# EAGLE design SolarBoard version 2.0 (EAGLE 7.6.0)
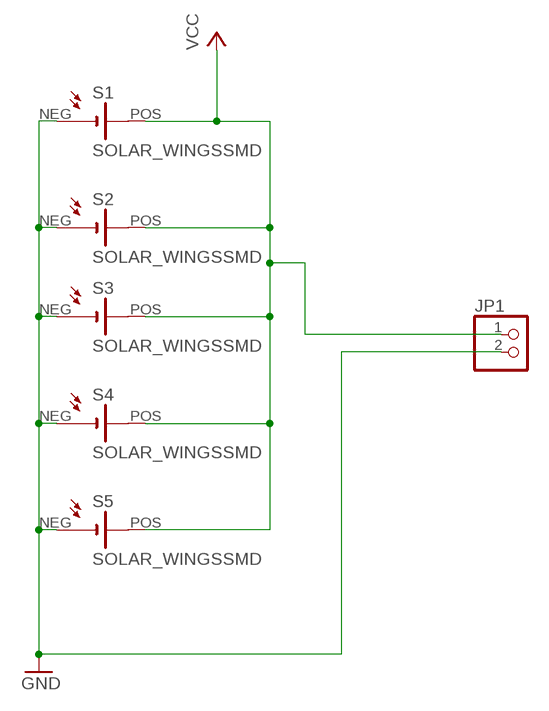
[diagram p0: schematic, sheet 1]

## Parts
JP1  PINHD-1X2  [1X02]
S1  SOLAR_WINGSSMD  [SOLAR_WINGS_SMD]
S2  SOLAR_WINGSSMD  [SOLAR_WINGS_SMD]
S3  SOLAR_WINGSSMD  [SOLAR_WINGS_SMD]
S4  SOLAR_WINGSSMD  [SOLAR_WINGS_SMD]
S5  SOLAR_WINGSSMD  [SOLAR_WINGS_SMD]

## Nets
GND: JP1.2 S1.NEG S2.NEG S3.NEG S4.NEG S5.NEG
VCC: JP1.1 S1.POS S2.POS S3.POS S4.POS S5.POS

## Library data of the parts
JP1 = pinhead:PINHD-1X2: PIN HEADER
S1-S5 = trisolx-ks:SOLAR_WINGS: 1 Sun: AM 1.5G -(100 mW/cm2) @ 25ᵒC, Voltage (Open Circuit): 2.62 V, Voltage (Max Power):2.33 V, Current (Max Power):14.6 mA, Power (Max Power): 34 mW, Efficiency: 28%, Temp Coeff. V (Max Power): -6.1 mV/ᵒC

## Board
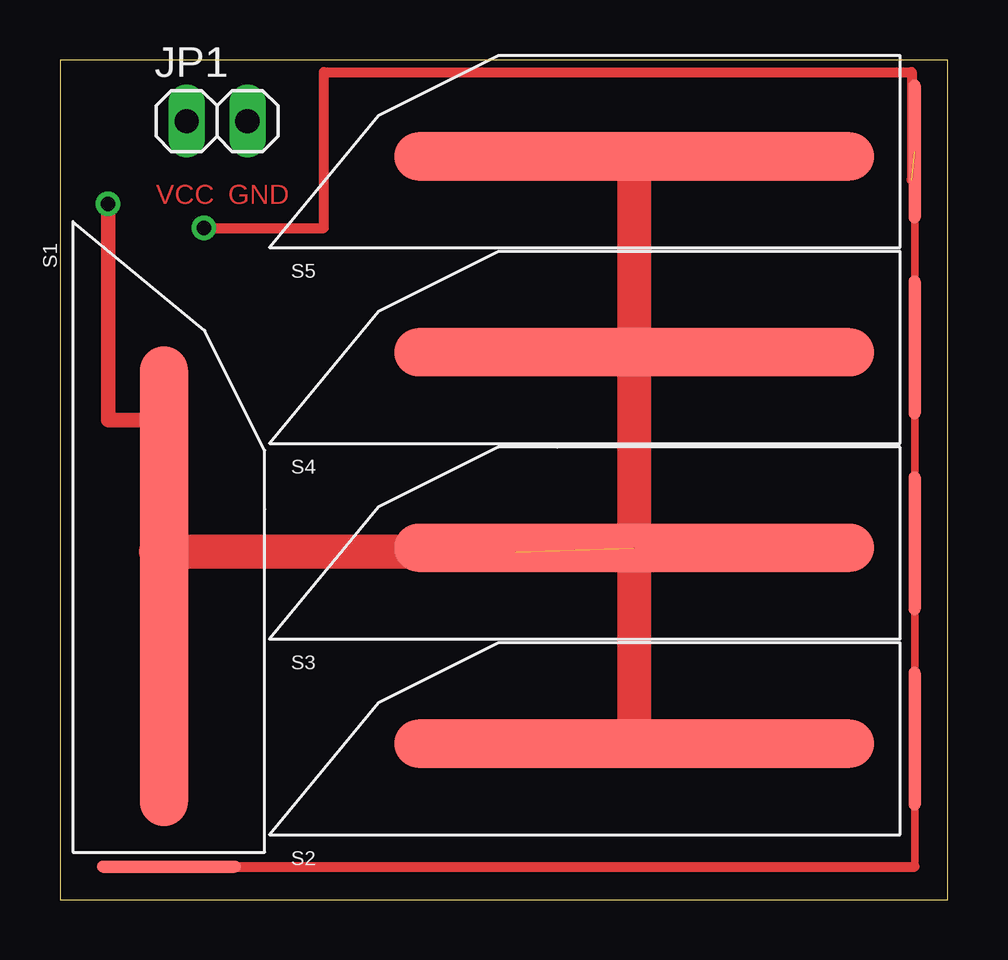
[diagram p1: board, top side]
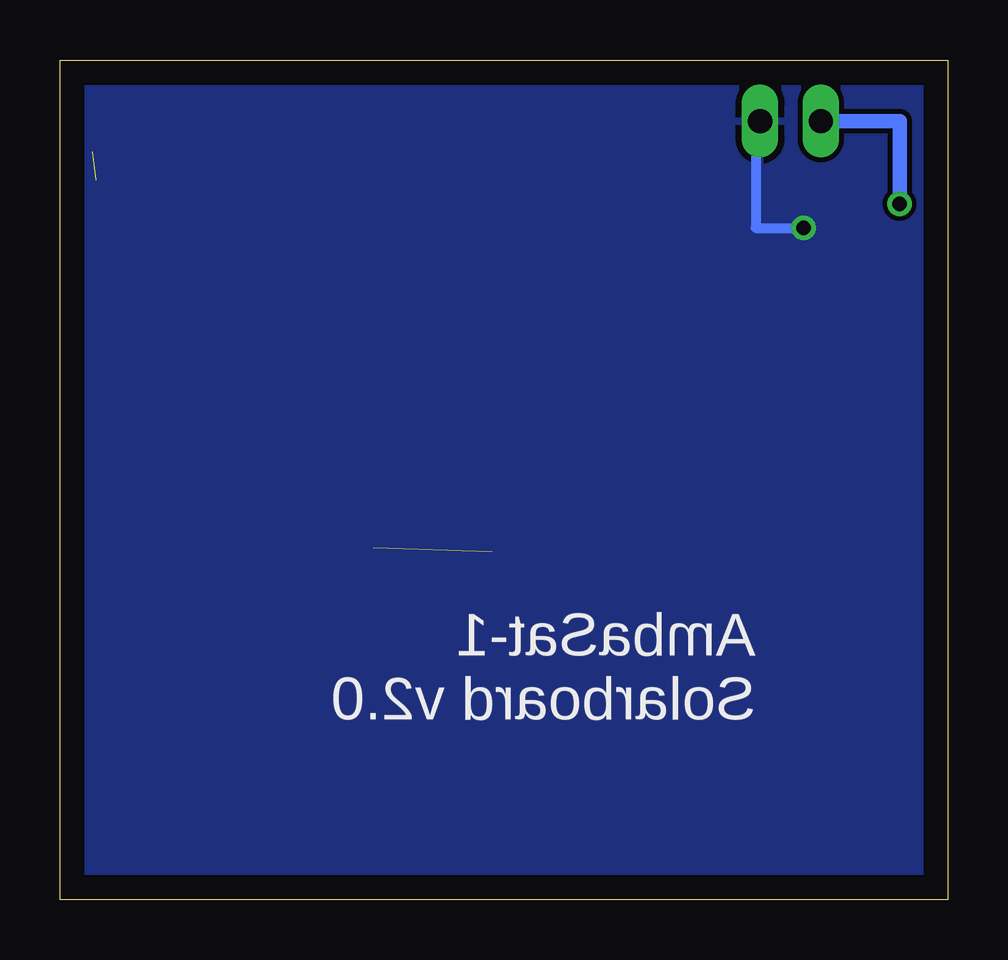
[diagram p2: board, bottom side, seen from below]

Size 37 x 35 mm. Coordinates in mm from the lower left corner, seen from the top.
Outline: 0,0 37,0 37,35 0,35 0,0
Copper layers (1*16): Top 0.035mm / dielectric 1.5mm / Bottom 0.035mm
Design rules "default": minimum track width 10mil, minimum drill 24mil, track to track 8mil, track to pad 8mil, pad to pad 8mil, via to via 8mil, smd to smd 8mil, copper to edge 40mil, drill to drill 8mil, minimum pad ring 10mil, minimum via ring 8mil, stop-mask expansion 4mil, vias tented up to drill 0mil, thermal gap 10mil

### Footprints (pad centres in the part's own frame; a part is rotated, then mirrored left to right if it is on the bottom)
1X02 = drill 1.016 long: 1 -1.27,0; 2 1.27,0
SOLAR_WINGS_SMD = smd 0.5 x 6: NEG 0.6,4 | smd 20 x 2: POS -11.1,3.8

### Placement (x,y rotation side)
JP1  6.55,32.45 0 top
S1  0.54,1.97 270 top
S2  35.03,2.7 0 top
S3  35.03,10.86 0 top
S4  35.03,19.02 0 top
S5  35.03,27.18 0 top

### Tracks (layer width: path | path; a pad name or v marks a point on that pad's centre or on a via)
GND  (via drill 0.6)  (1 unrouted)
  Top 0.305: 35.63,1.37 S2.NEG S3.NEG S4.NEG S5.NEG
  Top 0.406: v6,28 11,28 11,34.5 35.5,34.5 35.5,30 | S1.NEG 35.63,1.37
  Bottom 0.406: JP1.2 8,32.45 8,28 v6,28
  pour Bottom: 0,35 0,0 37,0 37,35
VCC  (via drill 0.6)  (1 unrouted)
  Top 0.61: v2,29 2,20 4,20 4,14.5 4,14 4.34,14 S1.POS
  Top 1.422: S5.POS S4.POS S3.POS S2.POS | 19,14.5 4,14.5
  Bottom 0.61: JP1.1 2,32.45 v2,29

### Text on the board
Top: VCC | GND
bPlace: AmbaSat-1 / Solarboard v2.0